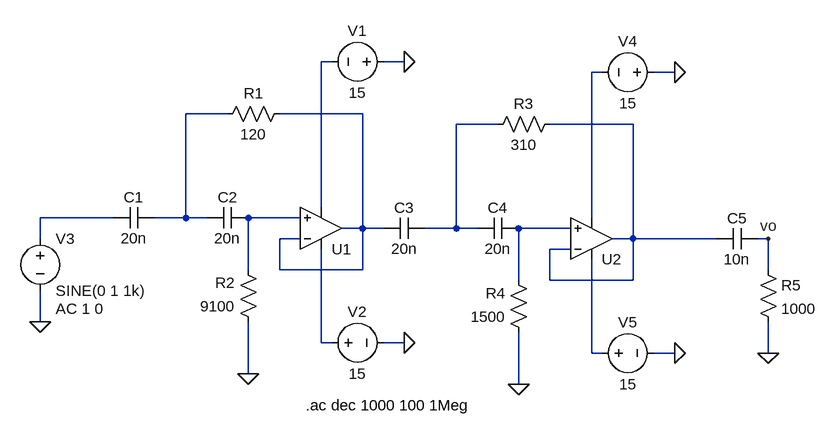
[diagram p0: schematic EJ6_SallenKey.asc]
EJ6_SallenKey.asc, the LTspice schematic file:
Version 4
SHEET 1 1124 680
WIRE 368 -64 352 -64
WIRE 480 -64 448 -64
WIRE 784 -48 768 -48
WIRE 896 -48 864 -48
WIRE 208 16 144 16
WIRE 416 16 288 16
WIRE 624 32 560 32
WIRE 832 32 704 32
WIRE 352 160 352 -64
WIRE 32 176 -80 176
WIRE 144 176 144 16
WIRE 144 176 96 176
WIRE 176 176 144 176
WIRE 320 176 240 176
WIRE 768 176 768 -48
WIRE 416 192 416 16
WIRE 416 192 384 192
WIRE 448 192 416 192
WIRE 560 192 560 32
WIRE 560 192 512 192
WIRE 592 192 560 192
WIRE 736 192 656 192
WIRE -80 208 -80 176
WIRE 320 208 288 208
WIRE 832 208 832 32
WIRE 832 208 800 208
WIRE 960 208 832 208
WIRE 1040 208 1024 208
WIRE 736 224 704 224
WIRE 240 256 240 176
WIRE 288 256 288 208
WIRE 416 256 416 192
WIRE 416 256 288 256
WIRE 1040 256 1040 208
WIRE 656 272 656 192
WIRE 704 272 704 224
WIRE 832 272 832 208
WIRE 832 272 704 272
WIRE -80 336 -80 288
WIRE 352 368 352 224
WIRE 368 368 352 368
WIRE 480 368 448 368
WIRE 768 384 768 240
WIRE 784 384 768 384
WIRE 896 384 864 384
WIRE 1040 384 1040 336
WIRE 240 416 240 336
WIRE 656 432 656 352
FLAG 1040 384 0
FLAG 1040 208 vo
FLAG 480 -64 0
FLAG 480 368 0
FLAG 240 416 0
FLAG 896 -48 0
FLAG 896 384 0
FLAG 656 432 0
FLAG -80 336 0
SYMBOL OpAmps\\UniversalOpAmp 352 192 M180
SYMATTR InstName U1
SYMBOL cap 1024 192 R90
WINDOW 0 0 32 VBottom 2
WINDOW 3 32 32 VTop 2
SYMATTR InstName C5
SYMATTR Value 10n
SYMBOL res 1024 240 R0
SYMATTR InstName R5
SYMATTR Value 1000
SYMBOL voltage 464 -64 R90
WINDOW 0 -32 56 VBottom 2
WINDOW 3 32 56 VTop 2
WINDOW 123 0 0 Left 0
WINDOW 39 0 0 Left 0
SYMATTR InstName V1
SYMATTR Value 15
SYMBOL voltage 352 368 R270
WINDOW 0 32 56 VTop 2
WINDOW 3 -32 56 VBottom 2
WINDOW 123 0 0 Left 0
WINDOW 39 0 0 Left 0
SYMATTR InstName V2
SYMATTR Value 15
SYMBOL cap 96 160 R90
WINDOW 0 0 32 VBottom 2
WINDOW 3 32 32 VTop 2
SYMATTR InstName C1
SYMATTR Value 20n
SYMBOL cap 240 160 R90
WINDOW 0 0 32 VBottom 2
WINDOW 3 32 32 VTop 2
SYMATTR InstName C2
SYMATTR Value 20n
SYMBOL res 304 0 R90
WINDOW 0 0 56 VBottom 2
WINDOW 3 32 56 VTop 2
SYMATTR InstName R1
SYMATTR Value 120
SYMBOL voltage -80 192 R0
WINDOW 123 24 124 Left 2
WINDOW 39 0 0 Left 0
SYMATTR InstName V3
SYMATTR Value SINE(0 1 1k)
SYMATTR Value2 AC 1 0
SYMBOL res 256 352 R180
WINDOW 0 36 76 Left 2
WINDOW 3 36 40 Left 2
SYMATTR InstName R2
SYMATTR Value 9100
SYMBOL OpAmps\\UniversalOpAmp 768 208 M180
SYMATTR InstName U2
SYMBOL voltage 880 -48 R90
WINDOW 0 -32 56 VBottom 2
WINDOW 3 32 56 VTop 2
WINDOW 123 0 0 Left 0
WINDOW 39 0 0 Left 0
SYMATTR InstName V4
SYMATTR Value 15
SYMBOL voltage 768 384 R270
WINDOW 0 32 56 VTop 2
WINDOW 3 -32 56 VBottom 2
WINDOW 123 0 0 Left 0
WINDOW 39 0 0 Left 0
SYMATTR InstName V5
SYMATTR Value 15
SYMBOL cap 512 176 R90
WINDOW 0 0 32 VBottom 2
WINDOW 3 32 32 VTop 2
SYMATTR InstName C3
SYMATTR Value 20n
SYMBOL cap 656 176 R90
WINDOW 0 0 32 VBottom 2
WINDOW 3 32 32 VTop 2
SYMATTR InstName C4
SYMATTR Value 20n
SYMBOL res 720 16 R90
WINDOW 0 0 56 VBottom 2
WINDOW 3 32 56 VTop 2
SYMATTR InstName R3
SYMATTR Value 310
SYMBOL res 672 368 R180
WINDOW 0 36 76 Left 2
WINDOW 3 36 40 Left 2
SYMATTR InstName R4
SYMATTR Value 1500
TEXT 328 464 Left 2 !.ac dec 1000 100 1Meg

The netlist it stands for:
* EJ6_SallenKey.asc
XU1 N008 N004 N010 N001 N004 level1 Avol=1Meg GBW=10Meg Vos=0 En=0 Enk=0 In=0 Ink=0 Rin=500Meg  ; pins In+ In- V+ V- OUT
C5 vo N006 10n
R5 vo 0 1000
V1 0 N001 15
V2 N010 0 15
C1 N003 N007 20n
C2 N008 N003 20n
R1 N004 N003 120
V3 N007 0 SINE(0 1 1k) AC 1 0
R2 0 N008 9100
XU2 N009 N006 N011 N002 N006 level1 Avol=1Meg GBW=10Meg Vos=0 En=0 Enk=0 In=0 Ink=0 Rin=500Meg  ; pins In+ In- V+ V- OUT
V4 0 N002 15
V5 N011 0 15
C3 N005 N004 20n
C4 N009 N005 20n
R3 N006 N005 310
R4 0 N009 1500
.ac dec 1000 100 1Meg
.lib UniversalOpAmp1.lib
.backanno
.end